# Altium schematic sheet Sheet2.SchDoc
size A2
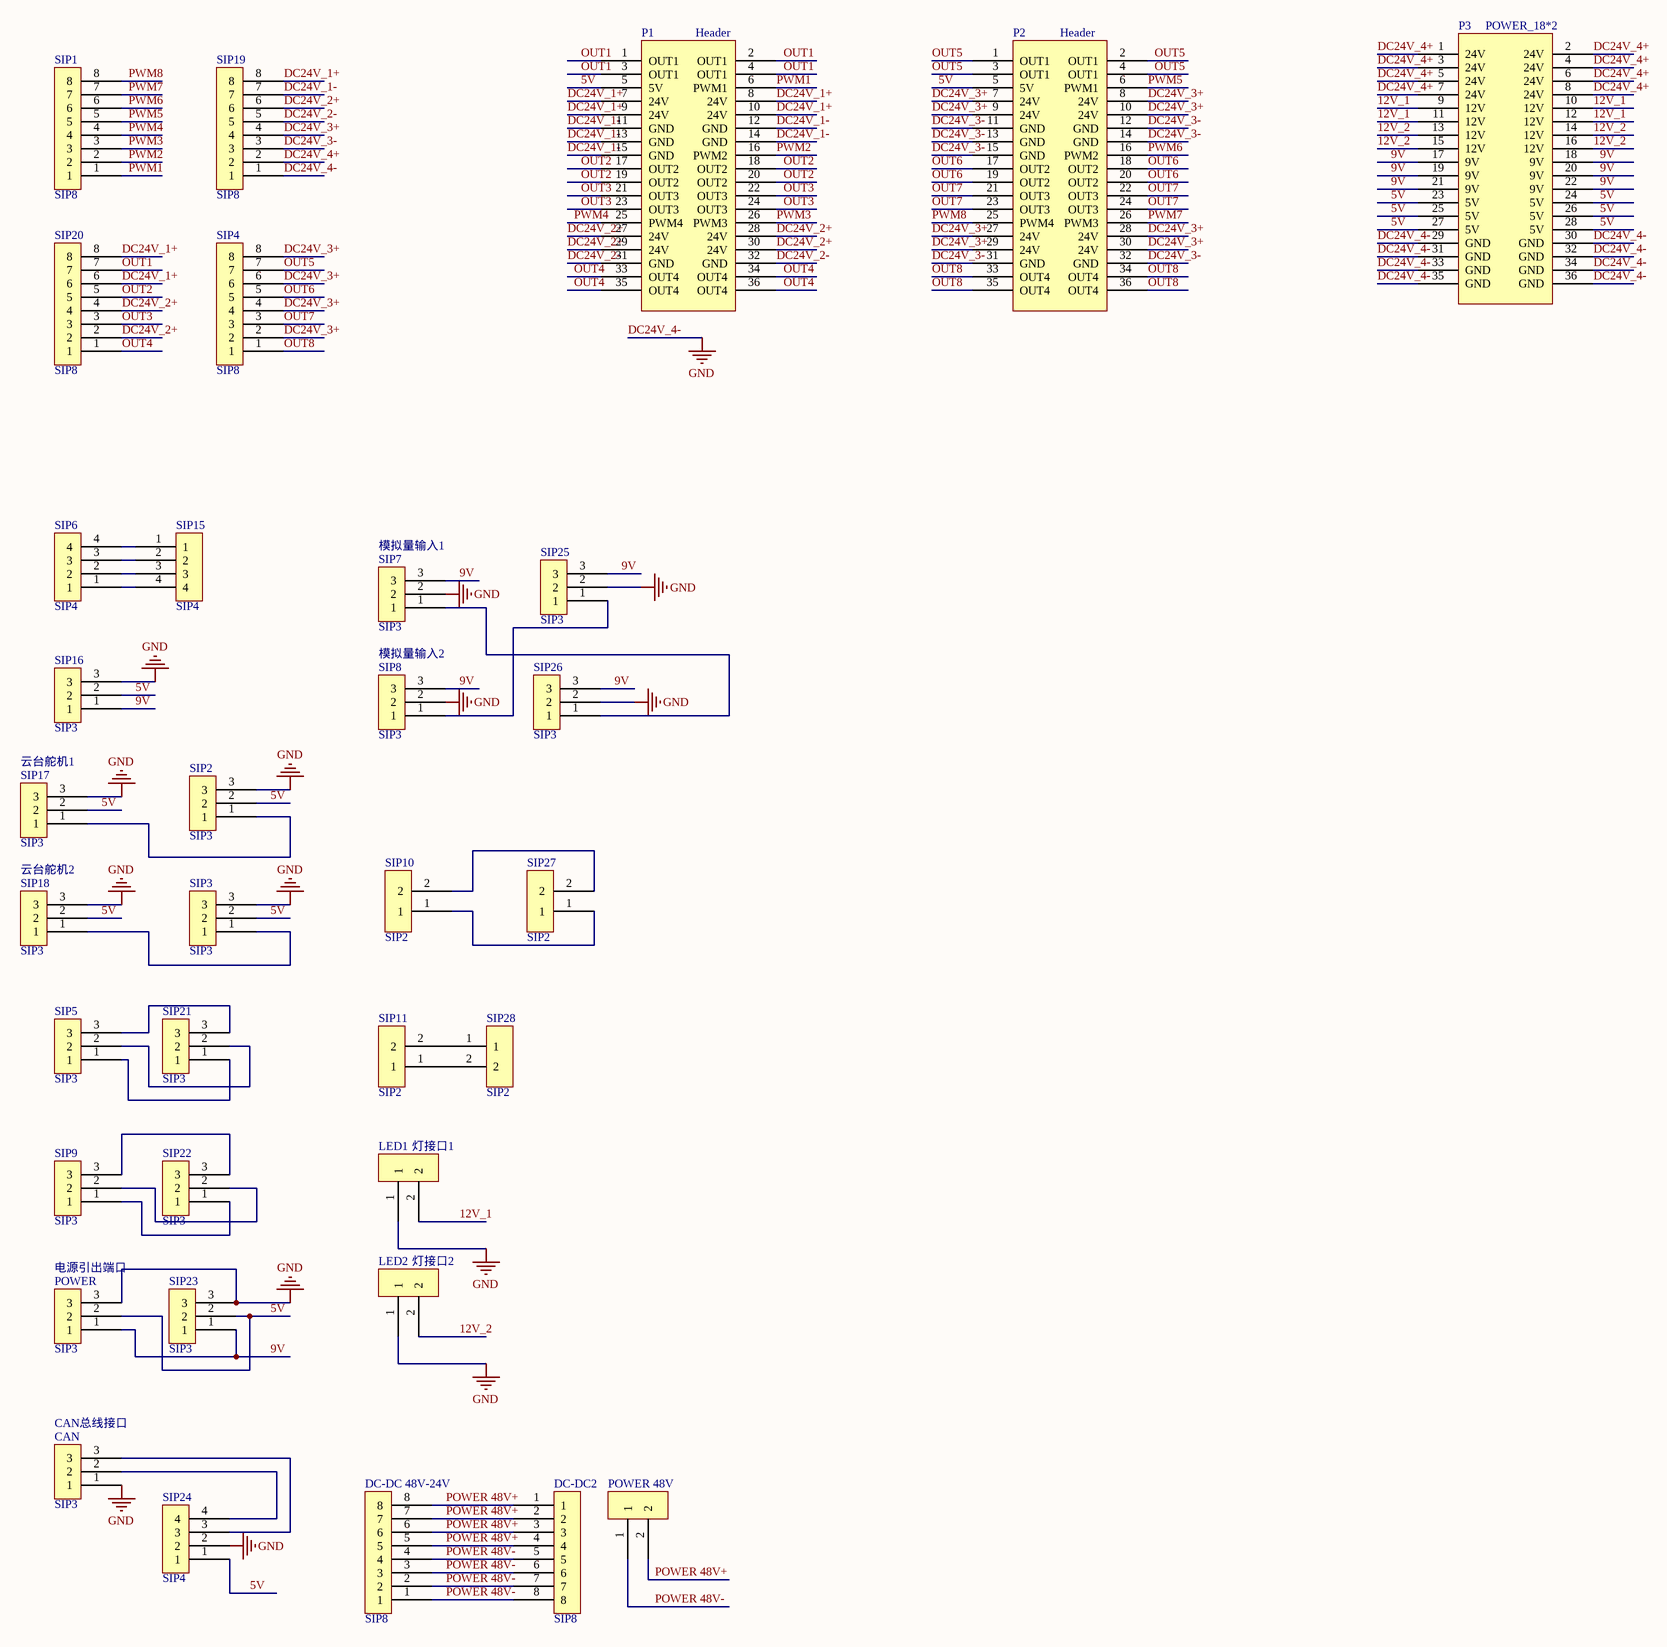
[diagram p0: Sheet2.SchDoc]

## Parts
CAN  SIP3  [SIP3]
DC-DC2  SIP8  [DIP8-3MM]
DC-DC_48V-24V  SIP8  [DIP8-3MM]
LED1  SIP2  [SIP2-3MM]  (value not drawn)
LED2  SIP2  [SIP2-3MM]  (value not drawn)
P1  Header  [DIP36-3.96MM]
P2  Header  [DIP36-3.96MM]
P3  POWER_18*2  [DIP36-3.96MM]
POWER  SIP3  [SIP3]
POWER_48V  SIP2  [SIP2-3MM]  (value not drawn)
SIP1  SIP8  [SIP8]
SIP2  SIP3  [SIP3]
SIP3  SIP3  [SIP3]
SIP4  SIP8  [DIP8-3MM]
SIP5  SIP3  [SIP3]
SIP6  SIP4  [SIP4]
SIP7  SIP3  [SIP3]
SIP8  SIP3  [SIP3]
SIP9  SIP3  [SIP3]
SIP10  SIP2  [SIP2]
SIP11  SIP2  [SIP2]
SIP15  SIP4  [SIP4]
SIP16  SIP3  [SIP3]
SIP17  SIP3  [SIP3]
SIP18  SIP3  [SIP3]
SIP19  SIP8  [DIP8-3MM]
SIP20  SIP8  [DIP8-3MM]
SIP21  SIP3  [SIP3]
SIP22  SIP3  [SIP3]
SIP23  SIP3  [SIP3]
SIP24  SIP4  [SIP4]
SIP25  SIP3  [SIP3]
SIP26  SIP3  [SIP3]
SIP27  SIP2  [SIP2]
SIP28  SIP2  [SIP2]

## Nets
DC24V_4-: CAN.1 LED1.1 LED2.1 P3.29(GND) P3.30(GND) P3.31(GND) P3.32(GND) P3.33(GND) P3.34(GND) P3.35(GND) P3.36(GND) POWER.3 SIP2.3 SIP3.3 SIP7.2 SIP8.2 SIP16.3 SIP17.3 SIP18.3 SIP19.1 SIP23.3 SIP24.2 SIP25.2 SIP26.2  [also labelled GND]
5V: P1.5(5V) P2.5(5V) P3.23(5V) P3.24(5V) P3.25(5V) P3.26(5V) P3.27(5V) P3.28(5V) POWER.2 SIP2.2 SIP3.2 SIP16.2 SIP17.2 SIP18.2 SIP23.2 SIP24.1
9V: P3.17(9V) P3.18(9V) P3.19(9V) P3.20(9V) P3.21(9V) P3.22(9V) POWER.1 SIP7.3 SIP8.3 SIP16.1 SIP23.1 SIP25.3 SIP26.3
12V_1: LED1.2 P3.9(12V) P3.10(12V) P3.11(12V) P3.12(12V)
12V_2: LED2.2 P3.13(12V) P3.14(12V) P3.15(12V) P3.16(12V)
DC24V_1+: P1.7(24V) P1.8(24V) P1.9(24V) P1.10(24V) SIP19.8 SIP20.6 SIP20.8
DC24V_1-: P1.11(GND) P1.12(GND) P1.13(GND) P1.14(GND) P1.15(GND) SIP19.7
DC24V_2+: P1.27(24V) P1.28(24V) P1.29(24V) P1.30(24V) SIP19.6 SIP20.2 SIP20.4
DC24V_2-: P1.31(GND) P1.32(GND) SIP19.5
DC24V_3+: P2.7(24V) P2.8(24V) P2.9(24V) P2.10(24V) P2.27(24V) P2.28(24V) P2.29(24V) P2.30(24V) SIP4.2 SIP4.4 SIP4.6 SIP4.8 SIP19.4
DC24V_3-: P2.11(GND) P2.12(GND) P2.13(GND) P2.14(GND) P2.15(GND) P2.31(GND) P2.32(GND) SIP19.3
DC24V_4+: P3.1(24V) P3.2(24V) P3.3(24V) P3.4(24V) P3.5(24V) P3.6(24V) P3.7(24V) P3.8(24V) SIP19.2
OUT1: P1.1(OUT1) P1.2(OUT1) P1.3(OUT1) P1.4(OUT1) SIP20.7
OUT2: P1.17(OUT2) P1.18(OUT2) P1.19(OUT2) P1.20(OUT2) SIP20.5
OUT3: P1.21(OUT3) P1.22(OUT3) P1.23(OUT3) P1.24(OUT3) SIP20.3
OUT4: P1.33(OUT4) P1.34(OUT4) P1.35(OUT4) P1.36(OUT4) SIP20.1
OUT5: P2.1(OUT1) P2.2(OUT1) P2.3(OUT1) P2.4(OUT1) SIP4.7
OUT6: P2.17(OUT2) P2.18(OUT2) P2.19(OUT2) P2.20(OUT2) SIP4.5
OUT7: P2.21(OUT3) P2.22(OUT3) P2.23(OUT3) P2.24(OUT3) SIP4.3
OUT8: P2.33(OUT4) P2.34(OUT4) P2.35(OUT4) P2.36(OUT4) SIP4.1
POWER 48V+: DC-DC2.1 DC-DC2.2 DC-DC2.3 DC-DC2.4 DC-DC_48V-24V.5 DC-DC_48V-24V.6 DC-DC_48V-24V.7 DC-DC_48V-24V.8 POWER_48V.2
POWER 48V-: DC-DC2.5 DC-DC2.6 DC-DC2.7 DC-DC2.8 DC-DC_48V-24V.1 DC-DC_48V-24V.2 DC-DC_48V-24V.3 DC-DC_48V-24V.4 POWER_48V.1
PWM1: P1.6(PWM1) SIP1.1
PWM2: P1.16(PWM2) SIP1.2
PWM3: P1.26(PWM3) SIP1.3
PWM4: P1.25(PWM4) SIP1.4
PWM5: P2.6(PWM1) SIP1.5
PWM6: P2.16(PWM2) SIP1.6
PWM7: P2.26(PWM3) SIP1.7
PWM8: P2.25(PWM4) SIP1.8
NetCAN_2: CAN.2 SIP24.4
NetCAN_3: CAN.3 SIP24.3
NetSIP2_1: SIP2.1 SIP17.1
NetSIP3_1: SIP3.1 SIP18.1
NetSIP5_1: SIP5.1 SIP21.1
NetSIP5_2: SIP5.2 SIP21.2
NetSIP5_3: SIP5.3 SIP21.3
NetSIP6_1: SIP6.1 SIP15.4
NetSIP6_2: SIP6.2 SIP15.3
NetSIP6_3: SIP6.3 SIP15.2
NetSIP6_4: SIP6.4 SIP15.1
NetSIP7_1: SIP7.1 SIP26.1
NetSIP8_1: SIP8.1 SIP25.1
NetSIP9_1: SIP9.1 SIP22.1
NetSIP9_2: SIP9.2 SIP22.2
NetSIP9_3: SIP9.3 SIP22.3
NetSIP10_1: SIP10.1 SIP27.1
NetSIP10_2: SIP10.2 SIP27.2
NetSIP11_1: SIP11.1 SIP28.2
NetSIP11_2: SIP11.2 SIP28.1

## Notes on the sheet
- (near SIP7) 模拟量输入1
- 模拟量输入2
- (near SIP17) 云台舵机1
- 云台舵机2
- (near LED1) 灯接口1
- (near POWER) 电源引出端口
- (near LED2) 灯接口2
- (near CAN) CAN总线接口